# Altium schematic sheet Connector.SchDoc
size A4
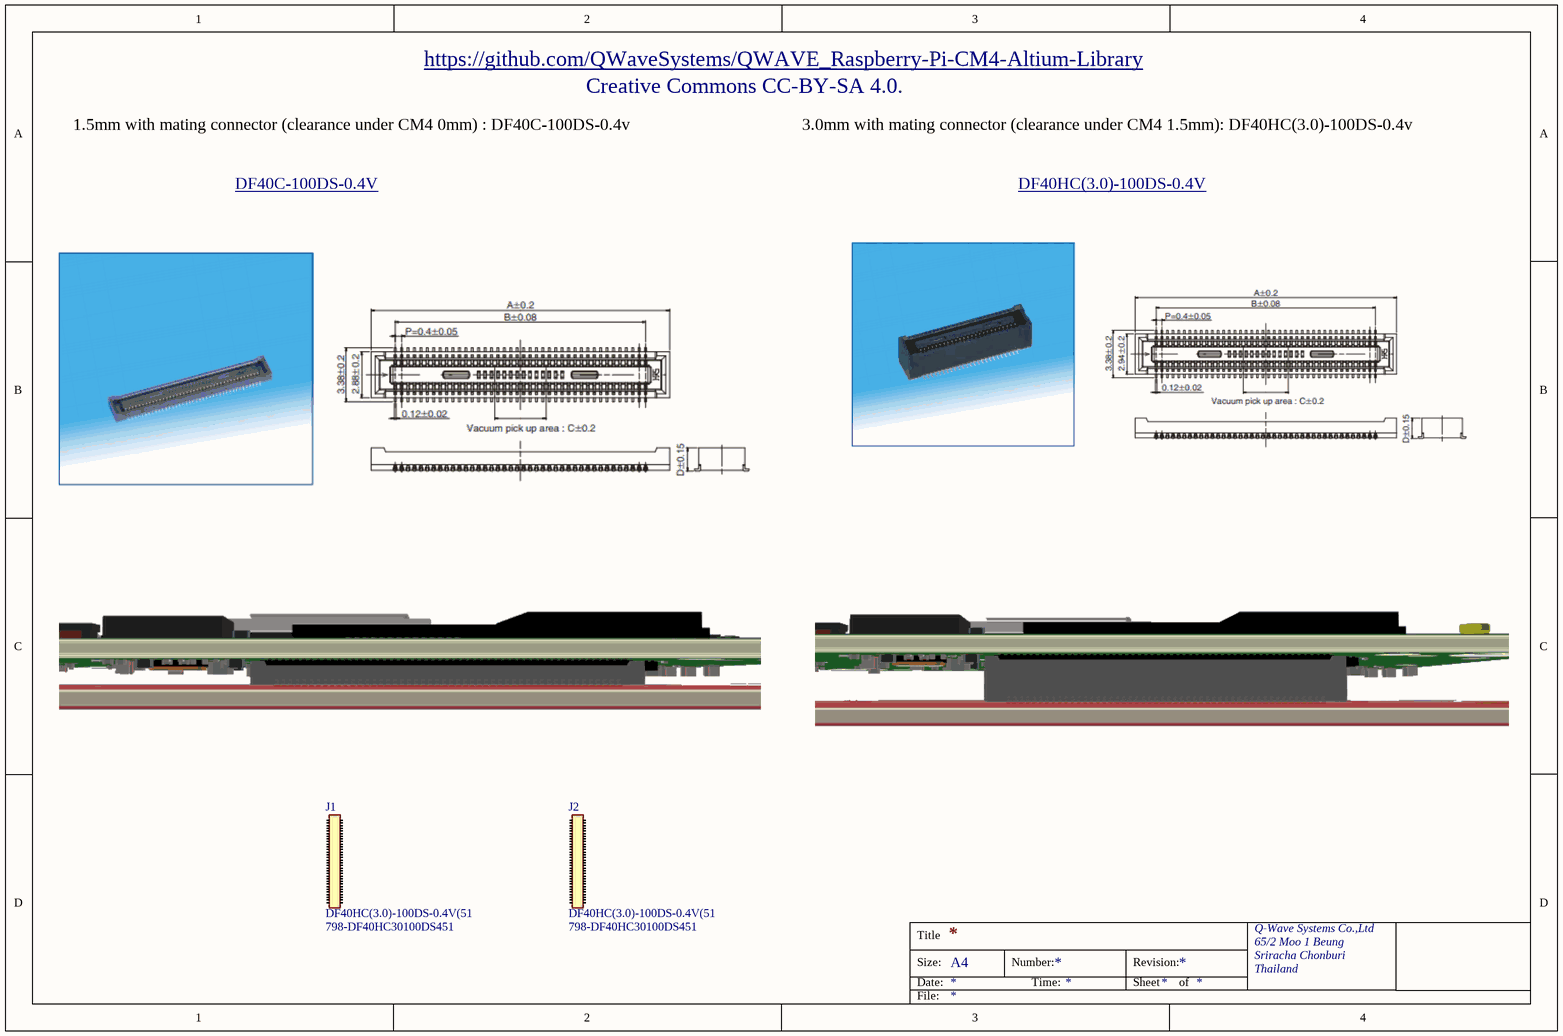
[diagram p0: Connector.SchDoc]

## Parts
J1  DF40HC(3.0)-100DS-0.4V(51  Supplier Part Number 1: 798-DF40HC30100DS451  [CM4-DF40]  (mechanical)
J2  DF40HC(3.0)-100DS-0.4V(51  Supplier Part Number 1: 798-DF40HC30100DS451  [CM4-DF40]  (mechanical)

## Notes on the sheet
- https://github.com/QWaveSystems/QWAVE_Raspberry-Pi-CM4-Altium-Library
- Creative Commons CC-BY-SA 4.0.
- 1.5mm with mating connector (clearance under CM4 0mm) : DF40C-100DS-0.4v
- 3.0mm with mating connector (clearance under CM4 1.5mm): DF40HC(3.0)-100DS-0.4v
- DF40C-100DS-0.4V <https://www.hirose.com/product/p/CL0684-4033-4-51>
- DF40HC(3.0)-100DS-0.4V <https://www.hirose.com/product/p/CL0684-4151-0-51>
- Title
- Size:
- Date:
- A4
- Number:
- Time:
- Revision:
- Sheet
- of
- Q-Wave Systems Co.,Ltd
- 65/2 Moo 1 Beung
- Sriracha Chonburi
- Thailand
- File:

## Library data of the parts
J1 J2 = DF40HC_3.0_-100DS-0.4V_51: Conn Board to Board RCP 100 POS 0.4mm Solder ST SMD T/R; Manufacturer_Name: Hirose; Connector Type: Receptacle; Number of Positions: 100; Pitch: 0.016inch; Datasheet Link: https://componentsearchengine.com/Datasheets/1/DF40HC(3.0)-100DS-0.4V(51.pdf; Height: 3.05mm; Manufacturer_Part_Number: DF40HC(3.0)-100DS-0.4V(51; Mouser Part Number: 798-DF40HC30100DS451; Mouser Price/Stock: https://www.mouser.co.uk/ProductDetail/Hirose-Connector/DF40HC30-100DS-04V51/?qs=%252BAZVS4b%2FkgIV%252B3vHYy2dCA%3D%3D; Arrow Part Number: DF40HC(3.0)-100DS-0.4V(51; Arrow Price/Stock: https://www.arrow.com/en/products/df40hc-3.0-100ds-0.4v-51/hirose-electric; Supplier 1: Mouser; Manufacturer: Hirose; Manufacturer Part Number: DF40HC(3.0)-100DS-0.4V(51; RoHS: Yes; Category: Headers and Wire Housings; Stock 1: 1901; Pricing 1: 1=2.50000, 10=2.15000, 50=2.15000, 100=2.00000, 1000=1.45000, 10000=1.29000 (USD); Mount: Surface Mount; Contact Plating: Gold; Package Quantity: 3000; Packaging: Tape and Reel; Number of Rows: 2; ComponentLink1URL: https://datasheet.ciiva.com/13559/ed-df40-20140305-13559540.pdf?src-supplier=Mouser; ComponentLink1Description: https://datasheet.ciiva.com/13559/ed-df40-20140305-13559540.pdf?src-supplier=Mouser; ComponentLink2URL: https://datasheet.ciiva.com/18562/ed-df40-20140305-18562462.pdf?src-supplier=Digi-Key; ComponentLink2Description: https://datasheet.ciiva.com/18562/ed-df40-20140305-18562462.pdf?src-supplier=Digi-Key